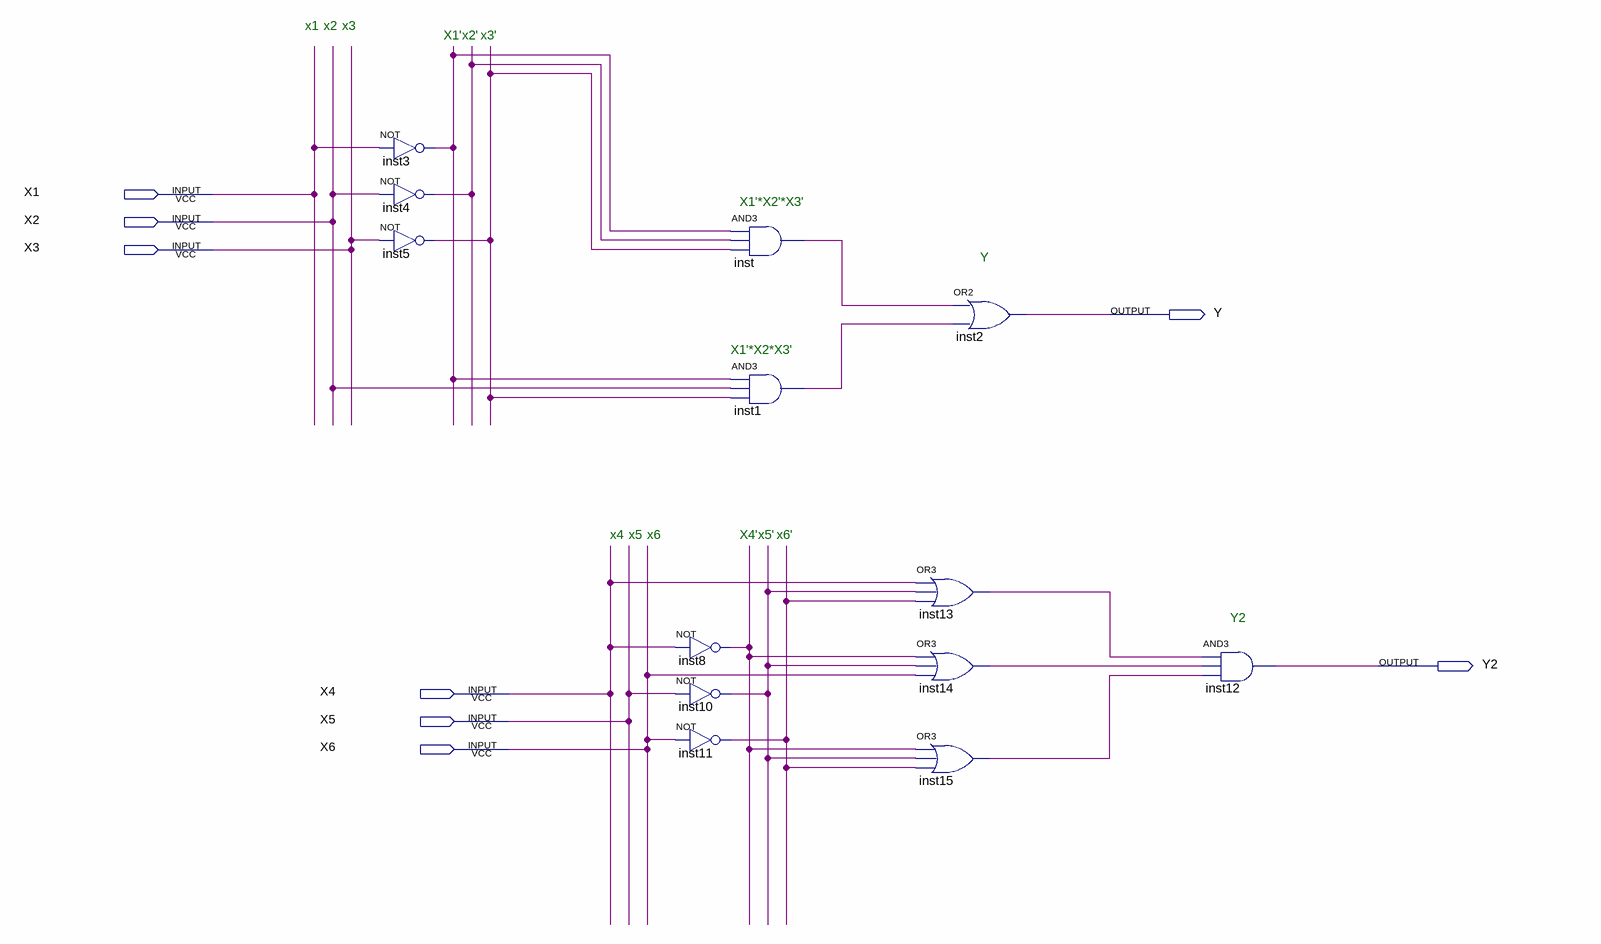
[diagram p0: schematic sheet]
// Quartus schematic Functions.bdf as structural Verilog: 13 symbols, 8 pins
module Functions (
  input  X1,
  input  X2,
  input  X3,
  input  X4,
  input  X5,
  input  X6,
  output Y,
  output Y2
);

  wire inst1_out, inst3_out, inst4_out, inst5_out, inst8_out, inst10_out, inst11_out, inst13_out, inst14_out,
       inst15_out, inst_out;

  not inst3 (inst3_out, X1);
  not inst4 (inst4_out, X2);
  not inst5 (inst5_out, X3);
  not inst8 (inst8_out, X4);
  not inst10 (inst10_out, X5);
  not inst11 (inst11_out, X6);
  and inst (inst_out, inst3_out, inst4_out, inst5_out);
  and inst1 (inst1_out, inst3_out, X2, inst5_out);
  or inst2 (Y, inst_out, inst1_out);
  or inst13 (inst13_out, X4, inst10_out, inst11_out);
  or inst14 (inst14_out, inst8_out, inst10_out, X6);
  or inst15 (inst15_out, inst8_out, inst10_out, inst11_out);
  and inst12 (Y2, inst13_out, inst14_out, inst15_out);

  // Notes on the sheet:
  //   x1
  //   x2
  //   x3
  //   X1'
  //   x2'
  //   x3'
  //   X1'*X2'*X3'
  //   Y
  //   X1'*X2*X3'
  //   x4
  //   x5
  //   x6
  //   X4'
  //   x5'
  //   x6'
  //   Y2
endmodule
